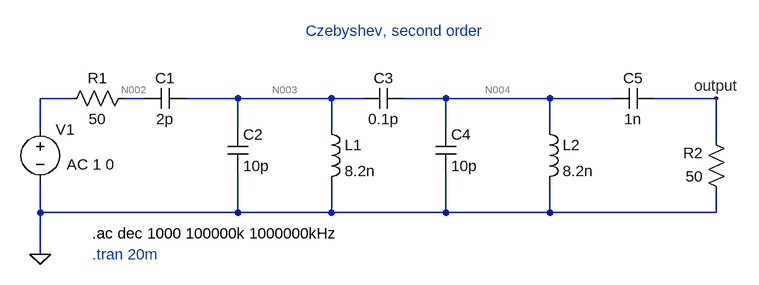
[diagram p0: schematic band_pass_filter.asc]
band_pass_filter.asc, the LTspice schematic file:
Version 4.1
SHEET 1 1080 680
WIRE 32 80 -16 80
WIRE 144 80 112 80
WIRE 288 80 208 80
WIRE 432 80 288 80
WIRE 480 80 432 80
WIRE 608 80 544 80
WIRE 768 80 608 80
WIRE 864 80 768 80
WIRE 1024 80 928 80
WIRE -16 128 -16 80
WIRE 288 128 288 80
WIRE 432 128 432 80
WIRE 608 128 608 80
WIRE 768 128 768 80
WIRE 1024 144 1024 80
WIRE -16 256 -16 208
WIRE 288 256 288 192
WIRE 288 256 -16 256
WIRE 432 256 432 208
WIRE 432 256 288 256
WIRE 608 256 608 192
WIRE 608 256 432 256
WIRE 768 256 768 208
WIRE 768 256 608 256
WIRE 1024 256 1024 224
WIRE 1024 256 768 256
WIRE -16 320 -16 256
FLAG 1024 80 output
FLAG -16 320 0
SYMBOL voltage -16 112 R0
WINDOW 3 41 92 Left 2
WINDOW 123 41 70 Left 2
WINDOW 39 0 0 Left 0
SYMATTR Value ""
SYMATTR Value2 AC 1 0
SYMATTR InstName V1
SYMBOL cap 208 64 R90
WINDOW 0 0 32 VBottom 2
WINDOW 3 32 32 VTop 2
SYMATTR InstName C1
SYMATTR Value 2p
SYMBOL cap 272 128 R0
SYMATTR InstName C2
SYMATTR Value 10p
SYMBOL ind 416 112 R0
SYMATTR InstName L1
SYMATTR Value 8.2n
SYMBOL cap 592 128 R0
SYMATTR InstName C4
SYMATTR Value 10p
SYMBOL ind 752 112 R0
SYMATTR InstName L2
SYMATTR Value 8.2n
SYMBOL cap 928 64 R90
WINDOW 0 0 32 VBottom 2
WINDOW 3 32 32 VTop 2
SYMATTR InstName C5
SYMATTR Value 1n
SYMBOL res 128 64 R90
WINDOW 0 0 56 VBottom 2
WINDOW 3 32 56 VTop 2
SYMATTR InstName R1
SYMATTR Value 50
SYMBOL res 1040 240 R180
WINDOW 0 36 76 Left 2
WINDOW 3 36 40 Left 2
SYMATTR InstName R2
SYMATTR Value 50
SYMBOL cap 544 64 R90
WINDOW 0 0 32 VBottom 2
WINDOW 3 32 32 VTop 2
SYMATTR InstName C3
SYMATTR Value 0.1p
TEXT 64 288 Left 2 !.ac dec 1000 100000k 1000000kHz
TEXT 64 320 Left 2 ;.tran 20m
TEXT 392 -24 Left 2 ;Czebyshev, second order

The netlist it stands for:
* band_pass_filter.asc
V1 N001 0 AC 1 0
C1 N003 N002 2p
C2 N003 0 10p
L1 N003 0 8.2n
C4 N004 0 10p
L2 N004 0 8.2n
C5 output N004 1n
R1 N002 N001 50
R2 0 output 50
C3 N004 N003 0.1p
.ac dec 1000 100000k 1000000kHz
* .tran 20m
* Czebyshev, second order
.backanno
.end

* Results of the author's LTspice run, read from the files saved beside the schematic
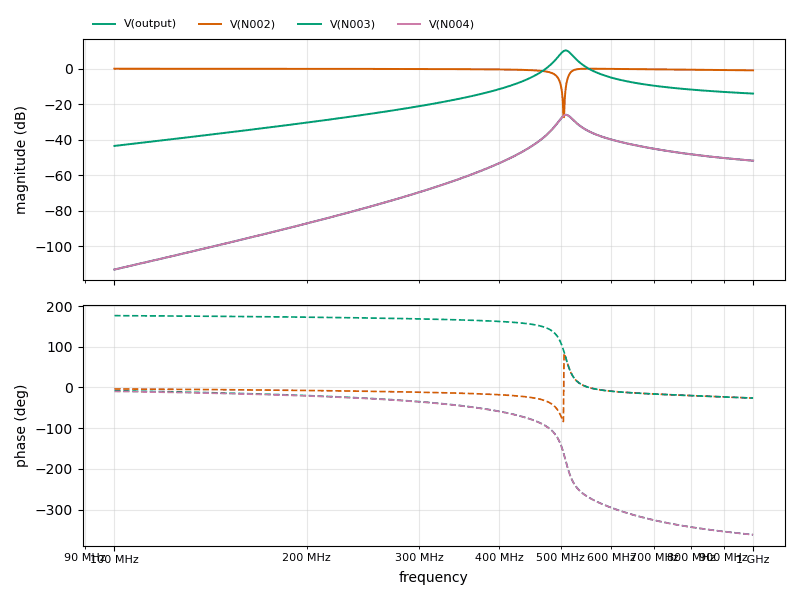
[diagram p1: AC Analysis of band_pass_filter.asc, plotted from the saved traces]
* AC Analysis, 1 run:
*   V(output): -112.98 dB at 100 MHz, -51.74 dB at 1 GHz, peak -25.96 dB at 509.3 MHz, 3 dB below the peak at 497.8 MHz and 523.3 MHz
*   V(N002): -0.02 dB at 100 MHz, -0.93 dB at 1 GHz, peak -0.00 dB at 553.4 MHz, 3 dB below the peak at 515.9 MHz
*   V(N003): -43.45 dB at 100 MHz, -14.00 dB at 1 GHz, peak 10.29 dB at 509.3 MHz, 3 dB below the peak at 496.7 MHz and 522 MHz
*   V(N004): -112.97 dB at 100 MHz, -51.74 dB at 1 GHz, peak -25.96 dB at 509.3 MHz, 3 dB below the peak at 497.8 MHz and 523.3 MHz